# EasyEDA Pro project DRV8701_驱动.epro

# Schematic Schematic1
Board Name: Board1; Create Date: 2024-05-03; Page Name: P1; Project Name: 驱动; Schematic Name: Schematic1; Update Date: 2024-12-27; Company: 嘉立创EDA; Page Size: A4; Version: V1.0
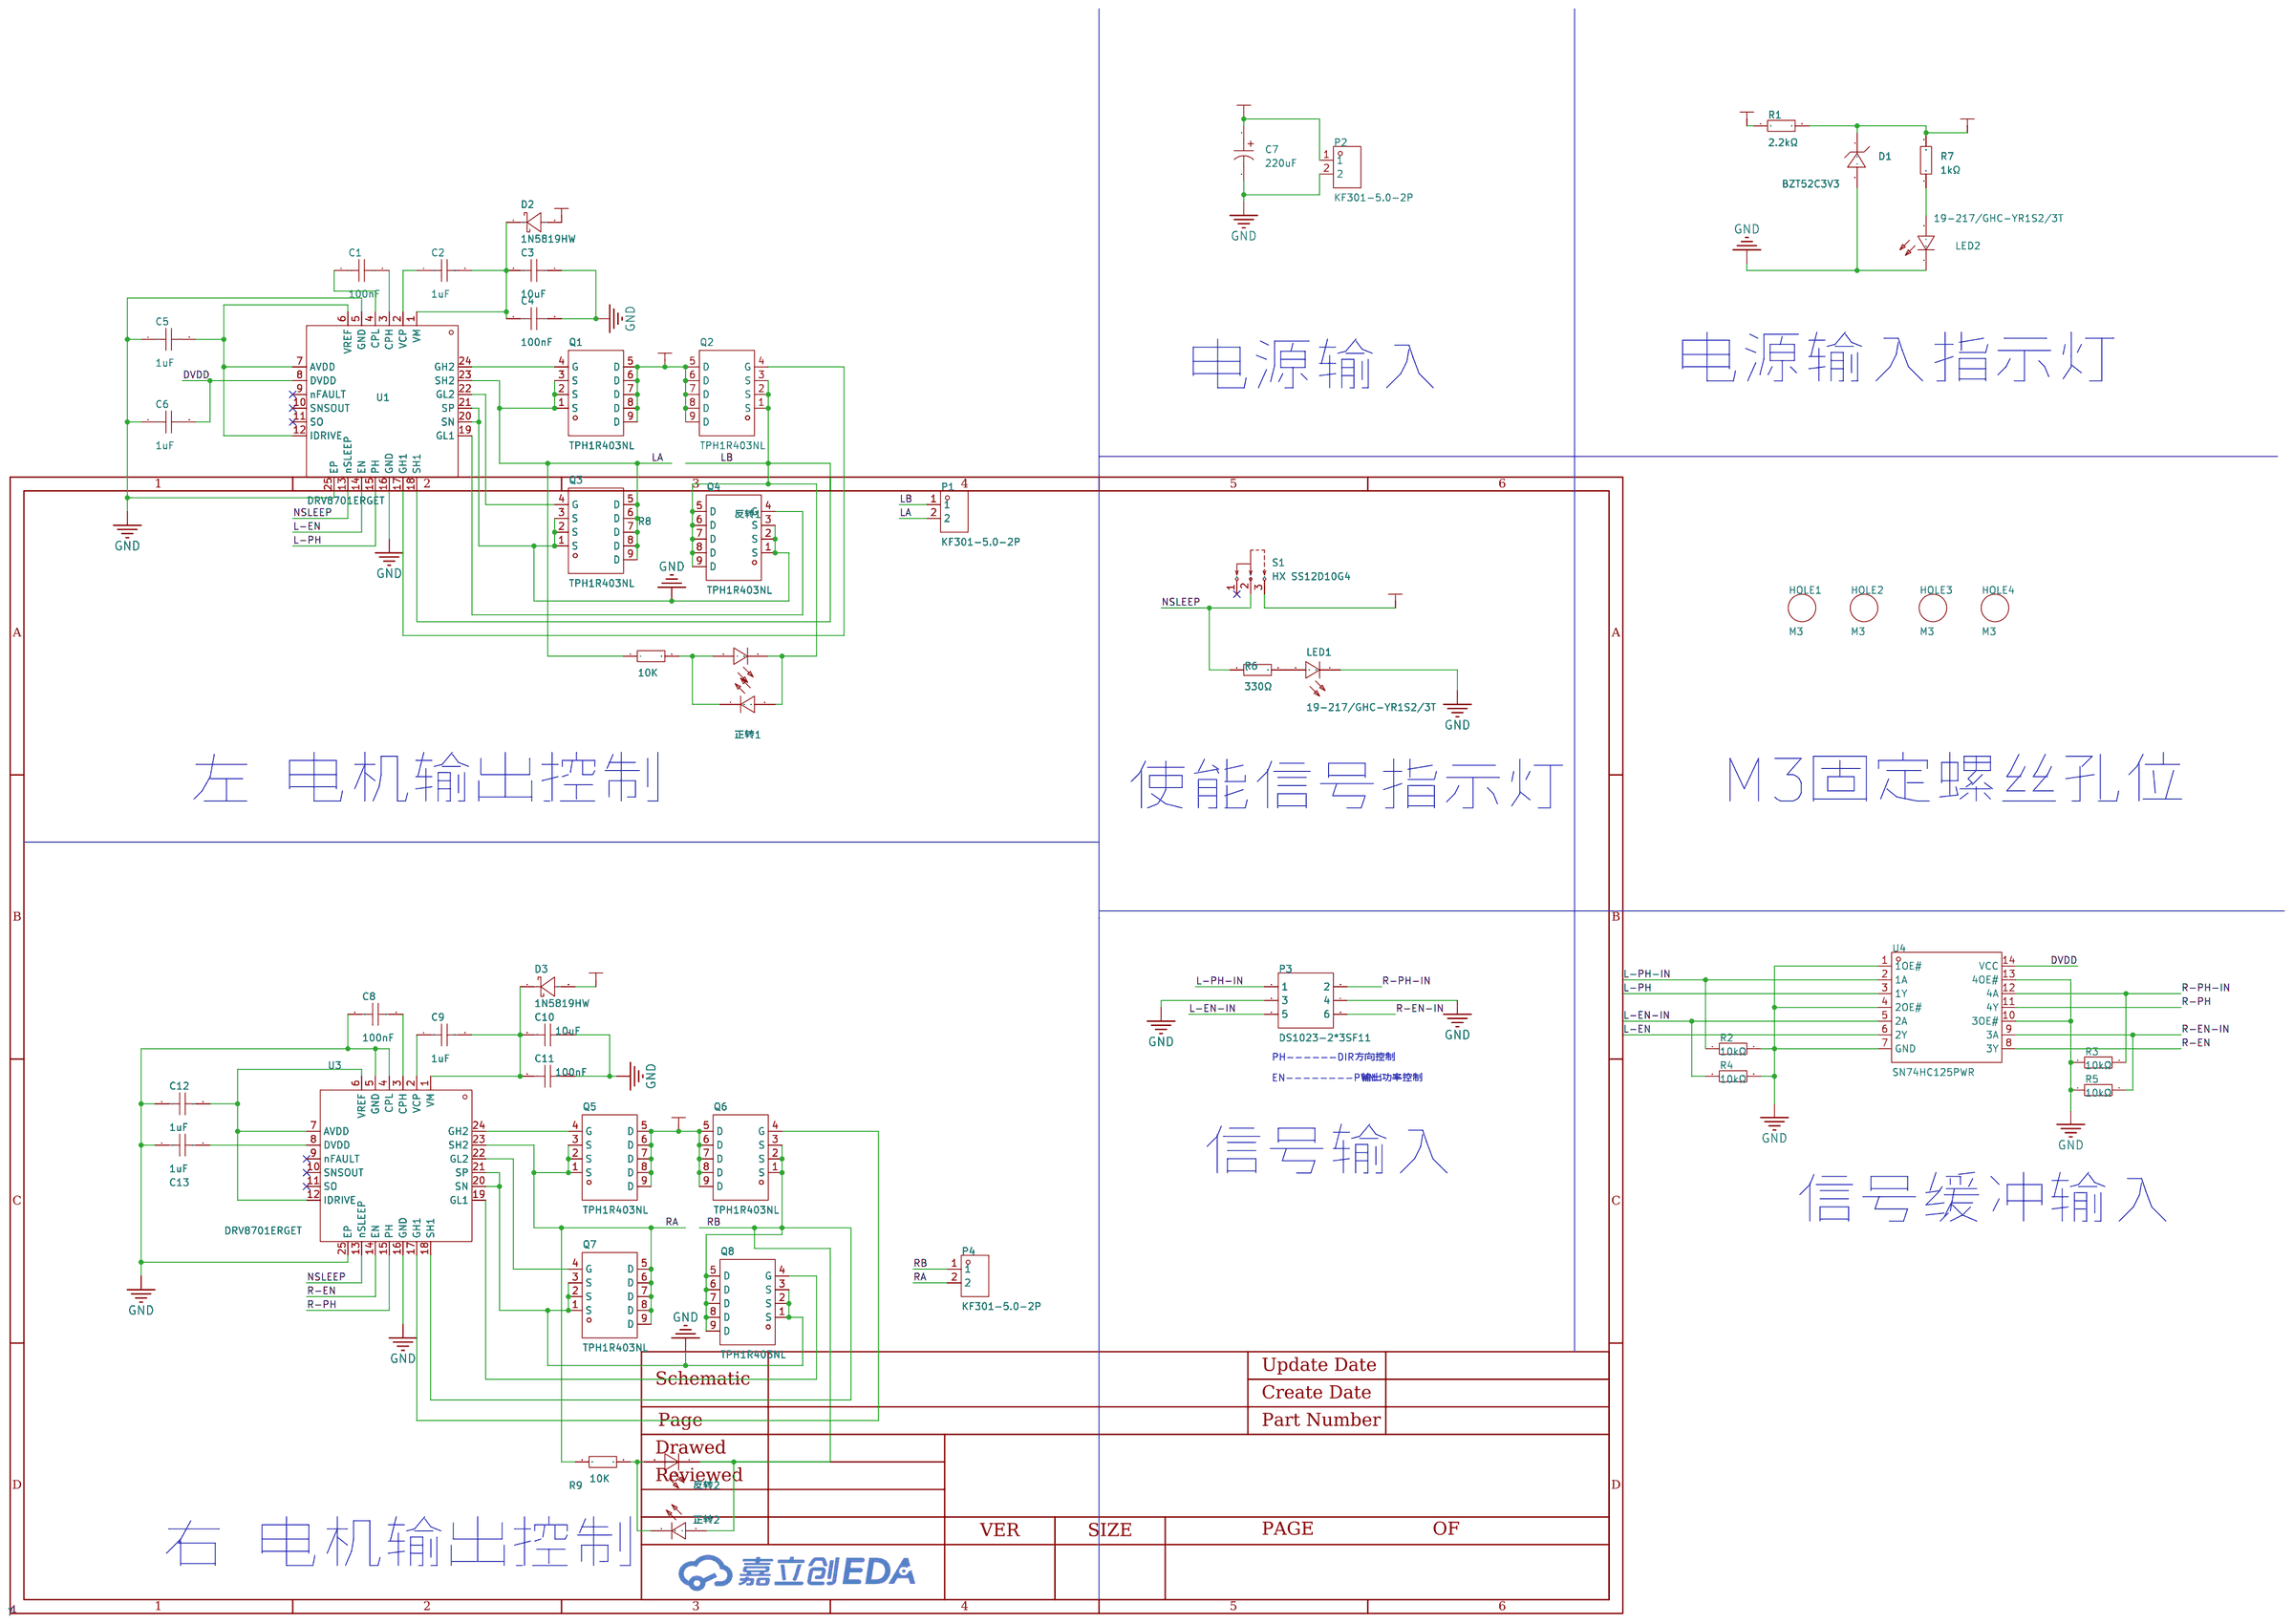
[diagram p0: schematic sheet]

## Parts
C1  100nF  [C0603]
C2  1uF  [C0603]
C3  10uF  [C0603]
C4  100nF  [C0603]
C5  1uF  [C0603]
C6  1uF  [C0603]
C7  220uF  [CAP-TH_BD6.3-P2.50-D1.0-FD]
C8  100nF  [C0603]
C9  1uF  [C0603]
C10  10uF  [C0603]
C11  100nF  [C0603]
C12  1uF  [C0603]
C13  1uF  [C0603]
D1  BZT52C3V3  [SOD-123_L2.8-W1.8-LS3.7-RD]
D2  1N5819HW  [SOD-123_L2.7-W1.6-LS3.7-RD-1]
D3  1N5819HW  [SOD-123_L2.7-W1.6-LS3.7-RD-1]
HOLE1  M3  [M3 5.4MM]
HOLE2  M3  [M3 5.4MM]
HOLE3  M3  [M3 5.4MM]
HOLE4  M3  [M3 5.4MM]
LED1  19-217/GHC-YR1S2/3T  [LED0603-RD]
LED2  19-217/GHC-YR1S2/3T  [LED0603-RD]
P1  KF301-5.0-2P  [CONN-TH_P5.00_KF301-5.0-2P]
P2  KF301-5.0-2P  [CONN-TH_P5.00_KF301-5.0-2P]
P3  DS1023-2*3SF11  [HDR-TH_6P-P2.54-V-F-R2-C3-S2.54]
P4  KF301-5.0-2P  [CONN-TH_P5.00_KF301-5.0-2P]
Q1  TPH1R403NL  [DSOP-8_L5.0-W5.0-P1.27-LS6.0-BL-EP]
Q2  TPH1R403NL  [DSOP-8_L5.0-W5.0-P1.27-LS6.0-BL-EP]
Q3  TPH1R403NL  [DSOP-8_L5.0-W5.0-P1.27-LS6.0-BL-EP]
Q4  TPH1R403NL  [DSOP-8_L5.0-W5.0-P1.27-LS6.0-BL-EP]
Q5  TPH1R403NL  [DSOP-8_L5.0-W5.0-P1.27-LS6.0-BL-EP]
Q6  TPH1R403NL  [DSOP-8_L5.0-W5.0-P1.27-LS6.0-BL-EP]
Q7  TPH1R403NL  [DSOP-8_L5.0-W5.0-P1.27-LS6.0-BL-EP]
Q8  TPH1R403NL  [DSOP-8_L5.0-W5.0-P1.27-LS6.0-BL-EP]
R1  2.2kΩ  [R0603]
R2  10kΩ  [R0603]
R3  10kΩ  [R0603]
R4  10kΩ  [R0603]
R5  10kΩ  [R0603]
R6  330Ω  [R0603]
R7  1kΩ  [R0603]
R8  10K  [R0603]
R9  10K  [R0603]
S1  HX SS12D10G4  [SW-TH_SHOU-HAN_SS12D10G4]
U1  DRV8701ERGET  [VQFN-24_L4.0-W4.0-P0.50-BL-EP2.5]
U3  DRV8701ERGET  [VQFN-24_L4.0-W4.0-P0.50-BL-EP2.5]
U4  SN74HC125PWR  [TSSOP-14_L5.0-W4.4-P0.65-LS6.5-BL]
反转1  19-217/GHC-YR1S2/3T  [LED0603-RD]
反转2  19-217/GHC-YR1S2/3T  [LED0603-RD]
正转1  19-217/GHC-YR1S2/3T  [LED0603-RD]
正转2  19-217/GHC-YR1S2/3T  [LED0603-RD]

## Library data of the parts
C1 C4 C8 C11 = LD03YC104KAB2A\500: 容值:100nF;精度:±10%;额定电压:16V;材质(温度系数):X7R;; LCSC Part Name: 100nF ±10% 16V; Supplier Part: C2311502; Manufacturer: Kyocera AVX; Supplier Footprint: 0603; JLCPCB Part Class: Extended Part; Datasheet: https://atta.szlcsc.com/upload/public/pdf/source/20211207/B657114075C6FC0CF56B8CD471711F32.pdf; Supplier: LCSC; Tolerance: ±10%; Voltage Rated: 16V; Temperature Coefficient: X7R
C2 C5 C6 C9 C12 C13 = JMK063ABJ105MP-F: 容值:1uF;精度:±20%;额定电压:6.3V;材质(温度系数):X5R;; LCSC Part Name: 1uF ±20% 6.3V; Supplier Part: C87143; Manufacturer: TAIYO YUDEN(太诱); Supplier Footprint: 0201; JLCPCB Part Class: Extended Part; Datasheet: https://atta.szlcsc.com/upload/public/pdf/source/20161110/1478747660296.pdf; Supplier: LCSC; Tolerance: ±20%; Voltage Rated: 6.3V; Temperature Coefficient: X5R
C3 C10 = 10uF_C15415: 容值:10uF;精度:±20%;额定电压:16V;材质(温度系数):-;; LCSC Part Name: 10uF ±20% 16V; Supplier Part: C15415; Manufacturer: SAMSUNG(三星); Supplier Footprint: 0603; JLCPCB Part Class: Extended Part; Datasheet: https://atta.szlcsc.com/upload/public/pdf/source/20160103/1457707675960.pdf; Supplier: LCSC; Tolerance: ±20%; Voltage Rated: 16V
C7 = 25YXJ220M6.3X11: 容值:220uF;精度:±20%;额定电压:25V;纹波电流:400mA@100kHz;等效串联电阻:220mΩ@100kHz;; LCSC Part Name: 220uF ±20% 25V; Supplier Part: C88729; Manufacturer: rubycon(红宝石); Supplier Footprint: 插件,D6.3xL11mm; JLCPCB Part Class: Extended Part; Datasheet: https://atta.szlcsc.com/upload/public/pdf/source/20161125/1480067872683.pdf; Supplier: LCSC; Tolerance: ±20%; Rated Voltage: 25V; φD: 6.3mm; L: 11mm; Lead Spacing: 2.5mm; Ripple Current: 400mA@100kHz; Equivalent Series Resistance(ESR): 220mΩ@100kHz; Lifetime @ Temp: 7000hrs@105℃
D1 = BZT52C3V3_C2112: 二极管配置:独立式;稳压值(标称值):3.3V;稳压值(范围):3.1V~3.5V;精度:-;功率:350mW;反向电流(Ir):5uA@1V;阻抗(Zzt):95Ω;; LCSC Part Name: 3.3V 350mW; Supplier Part: C2112; Manufacturer: CJ(江苏长电/长晶); Supplier Footprint: SOD-123; JLCPCB Part Class: Extended Part; Datasheet: https://atta.szlcsc.com/upload/public/pdf/source/20170919/C2112_1505799672426977594.pdf; Supplier: LCSC; Diode Configuration: 独立式; Zener Voltage (Nom): 3.3V; Zener Voltage (Range): 3.1V~3.5V; Power Dissipation: 350mW; Reverse Leakage Current (Ir): 5uA@1V; Zener Impedance (Zzt): 95Ω
D2 D3 = 1N5819HW: 二极管配置:-;直流反向耐压(Vr):40V;平均整流电流(Io):1A;正向压降(Vf):900mV@3A;反向电流(Ir):1mA@40V;; LCSC Part Name: 40V 1A 900mV@3A; Supplier Part: C2905649; Manufacturer: TECH PUBLIC(台舟); Supplier Footprint: SOD-123; JLCPCB Part Class: Extended Part; Datasheet: https://atta.szlcsc.com/upload/public/pdf/source/20211020/8C6B6169F42B21129AF0D528B0E96B00.pdf; Supplier: LCSC; Reverse Voltage (Vr): 40V; Average Rectified Current (Io): 1A; Forward Voltage (Vf@If): 900mV@3A; Reverse Leakage Current (Ir): 1mA@40V
HOLE1-HOLE4 = M3: BOM名称: 铜柱孔; 学习资源: www.ooocke.com; 版权归属: 源创客
LED1 LED2 反转1 反转2 正转1 正转2 = 19-217/GHC-YR1S2/3T: 发光颜色:翠绿;二极管配置:-;主波长:520nm~535nm;色温:-;功率:110mW;安装方式:-;; Supplier Part: C72043; Manufacturer: EVERLIGHT(亿光); Supplier Footprint: 0603; JLCPCB Part Class: Basic Part; Datasheet: https://atta.szlcsc.com/upload/public/pdf/source/20160507/1462613613780.pdf; Supplier: LCSC; Emitted Color: 翠绿; Lens Color: 无色透明; Dominant Wavelength: 520nm~535nm; Peak Wavelength: 518nm; Forward Current: 20mA; Power Dissipation: 110mW; Viewing Angle: 120°; Operating Temperature: -40℃~+85℃
P1 P2 P4 = KF301-5.0-2P: 间距:5mm;排数:1;每排PIN数:2;安装方式:直针;额定电流:17A;额定电压:250V;线规 - AWG:14~22;线规 - mm?:1.5;工作温度范围:-30℃~+120℃;颜色:蓝色;; LCSC Part Name: 5mm 排数:1 每排P数:2 直针 可拼接 铜 环保; Supplier Part: C474881; Manufacturer: KEFA(科发); Supplier Footprint: 直插,P=5mm; JLCPCB Part Class: Extended Part; Datasheet: https://atta.szlcsc.com/upload/public/pdf/source/20200115/C474881_883EFE2003339C40FD1BEEEFC9A18423.pdf; Supplier: LCSC; Pitch: 5mm; Number of Rows: 1; Number of PINs Per Row: 2; Mounting Style: 直针; Current Rating (Max): 17A; Voltage Rating (Max): 250V; Wire Gauge - AWG: 14~22; Wire Gauge - mm?: 1.5; Operating Temperature Range: -30℃~+120℃; Color: 蓝色
P3 = DS1023-2*3SF11: 排数:双排;总孔位数:6;间距:2.54mm;插孔结构:2x3P;行距:2.54mm;安装类型:直插;塑高:-;触头材质:-;触头镀层:-;; LCSC Part Name: 2.54mm 2x3P; Supplier Part: C92272; Manufacturer: CONNFLY; Supplier Footprint: 插件,P=2.54mm; JLCPCB Part Class: Extended Part; Datasheet: https://atta.szlcsc.com/upload/public/pdf/source/20200424/C92272_A95D2DA05ACA87B9C9B122019351705D.pdf; Supplier: LCSC; Number of Rows: 双排; Number of Holes: 6; Pitch: 2.54mm; Holes Structure: 2x3P; Row Spacing: 2.54mm; Mounting Type: 直插
Q1-Q8 = TPH1R403NL_C83440: 类型:N沟道;漏源电压(Vdss):30V;连续漏极电流(Id):150A;功率(Pd):64W;导通电阻(RDS(on)@Vgs,Id):1.4mΩ@10V,30A;阈值电压(Vgs(th)@Id):2.3V@500uA;; LCSC Part Name: N沟道 30V 150A; Supplier Part: C83440; Manufacturer: TOSHIBA(东芝); Supplier Footprint: DSOP-8-EP-5.0mm; JLCPCB Part Class: Extended Part; Datasheet: https://atta.szlcsc.com/upload/public/pdf/source/20170908/C83440_1504870121708958077.pdf; Supplier: LCSC; Type: N沟道; Drain Source Voltage (Vdss): 30V; Continuous Drain Current (Id): 150A; Power Dissipation (Pd): 64W; Drain Source On Resistance (RDS(on)@Vgs,Id): 1.4mΩ@10V,30A; Gate Threshold Voltage (Vgs(th)@Id): 2.3V@500uA
R1 = RC0805JR-072K2L: 电阻类型:厚膜电阻;阻值:2.2kΩ;精度:±5%;功率:125mW;; LCSC Part Name: 2.2kΩ ±5% 125mW; Supplier Part: C114237; Manufacturer: YAGEO(国巨); Supplier Footprint: 0805; JLCPCB Part Class: Extended Part; Datasheet: https://atta.szlcsc.com/upload/public/pdf/source/20170705/1499242706674.pdf; Supplier: LCSC; Type: 厚膜电阻; Tolerance: ±5%; Power(Watts): 125mW; Temperature Coefficient: ±100ppm/℃; Overload Voltage (Max): 150V; Operating Temperature Range: -55℃~+155℃
R2-R5 = AC0603FR-0710KL: 电阻类型:厚膜电阻;阻值:10kΩ;精度:±1%;功率:100mW;; LCSC Part Name: 10kΩ ±1% 100mW; Supplier Part: C116677; Manufacturer: YAGEO(国巨); Supplier Footprint: 0603; JLCPCB Part Class: Extended Part; Datasheet: https://atta.szlcsc.com/upload/public/pdf/source/20171106/C116677_15099694143531094015.pdf; Supplier: LCSC; Type: 厚膜电阻; Tolerance: ±1%; Power(Watts): 100mW; Temperature Coefficient: ±100ppm/℃; Overload Voltage (Max): 75V; Operating Temperature Range: -55℃~+155℃
R6 = 0402WGF3300TCE: 电阻类型:厚膜电阻;阻值:330Ω;精度:±1%;功率:62.5mW;; LCSC Part Name: 330Ω ±1% 62.5mW; Supplier Part: C25104; Manufacturer: UNI-ROYAL(厚声); Supplier Footprint: 0402; JLCPCB Part Class: Basic Part; Datasheet: https://atta.szlcsc.com/upload/public/pdf/source/20200306/C422600_1E6D84923E4A46A82E41ADD87F860B5C.pdf; Supplier: LCSC; Type: 厚膜电阻; Tolerance: ±1%; Power(Watts): 62.5mW; Temperature Coefficient: ±100ppm/℃; Overload Voltage (Max): 50V; Operating Temperature Range: -55℃~+155℃
R7 = ACD03K102JT: 阻值:1kΩ;精度:±5%;功率:100mW;; LCSC Part Name: 1kΩ ±5% 100mW; Supplier Part: C347057; Manufacturer: FH(风华); Supplier Footprint: 0603; JLCPCB Part Class: Extended Part; Datasheet: https://atta.szlcsc.com/upload/public/pdf/source/20181211/C347057_E87C81A5B9F44443BA9931DC1484DEF8.pdf; Supplier: LCSC; Tolerance: ±5%; Power(Watts): 100mW; Temperature Coefficient: ±100ppm/℃; Overload Voltage (Max): 50V; Operating Temperature Range: -55℃~+155℃
R8 R9 = Res_0603: Supplier Footprint: 0603
S1 = HX SS12D10G4: LCSC Part Name: 拨动开关 立式两档拨动,单排3脚插件,12.7x6.7x6.4,黑柄4mm; Supplier Part: C5149841; Manufacturer: hanxia(韩下); Supplier Footprint: 插件; JLCPCB Part Class: Extended Part; Datasheet: https://atta.szlcsc.com/upload/public/pdf/source/20220907/2020D7183ED16DD6E2B9F5A13FB144CF.pdf; Supplier: LCSC
U1 U3 = DRV8701ERGET: 电源电压:0V~5.5V;输出电流:-;接口:并行;; Supplier Part: C132049; Manufacturer: TI(德州仪器); Supplier Footprint: VQFN-24(4x4); JLCPCB Part Class: Extended Part; Datasheet: https://atta.szlcsc.com/upload/public/pdf/source/20170925/C132049_1506321643935990409.pdf; Supplier: LCSC; Type: 有刷直流电机; Supply Voltage: 0V~5.5V; Interface: 并行; Operating Temperature: -40℃~+125℃@(Ta)
U4 = SN74HC125PWR: 类型:缓冲器，非反相;电源电压:2V~6V;输入类型:-;输出类型:三态;低电平输出电流(IOL):7.8mA;高电平输出电流(IOH):7.8mA;工作温度:-40℃~+85℃;; Supplier Part: C132994; Manufacturer: TI(德州仪器); Supplier Footprint: TSSOP-14; JLCPCB Part Class: Extended Part; Datasheet: https://atta.szlcsc.com/upload/public/pdf/source/20170930/C132994_1506736365150997346.pdf; Supplier: LCSC; Type: 缓冲器，非反相; Supply Voltage: 2V~6V; output type: 三态; Current-OutputLow: 7.8mA; Current-OutputHigh: 7.8mA; Operating temperature: -40℃~+85℃

## Nets
3V3: D1.1(K) R1.2 R7.2 S1.3
DVDD: C6.2 U1.8(DVDD) U4.14(VCC)
GND: C3.1 C4.2 C5.1 C6.1 C7.2 C8.1 C10.1 C11.2 C12.1 C13.1 D1.2(A) LED1.1(C) LED2.1(C) P2.2 P3.3 P3.4 Q3.1(S) Q3.2(S) Q3.3(S) Q4.1(S) Q4.2(S) Q4.3(S) Q7.1(S) Q7.2(S) Q7.3(S) Q8.1(S) Q8.2(S) Q8.3(S) R2.2 R3.1 R4.2 R5.1 U1.5(GND) U1.16(GND) U1.20(SN) U1.21(SP) U1.25(EP) U3.4(CPL) U3.5(GND) U3.16(GND) U3.20(SN) U3.21(SP) U3.25(EP) U4.1(1OE#) U4.4(2OE#) U4.7(GND) U4.10(3OE#) U4.13(4OE#)
L-EN: U1.14(EN) U4.6(2Y)
L-EN-IN: P3.5 R4.1 U4.5(2A)
L-PH: U1.15(PH) U4.3(1Y)
L-PH-IN: P3.1 R2.1 U4.2(1A)
LA: P1.2 Q1.1(S) Q1.2(S) Q1.3(S) Q3.5(D) Q3.6(D) Q3.7(D) Q3.8(D) Q3.9(D) R8.1 U1.23(SH2)
LB: P1.1 Q2.1(S) Q2.2(S) Q2.3(S) Q4.5(D) Q4.6(D) Q4.7(D) Q4.8(D) Q4.9(D) U1.18(SH1) 反转1.1(C) 正转1.2(A)
NSLEEP: R6.1 S1.2 U1.13(nSLEEP) U3.13(nSLEEP)
R-EN: U3.14(EN) U4.8(3Y)
R-EN-IN: P3.6 R5.2 U4.9(3A)
R-PH: U3.15(PH) U4.11(4Y)
R-PH-IN: P3.2 R3.2 U4.12(4A)
RA: P4.2 Q5.1(S) Q5.2(S) Q5.3(S) Q7.5(D) Q7.6(D) Q7.7(D) Q7.8(D) Q7.9(D) R9.1 U3.23(SH2)
RB: P4.1 Q6.1(S) Q6.2(S) Q6.3(S) Q8.5(D) Q8.6(D) Q8.7(D) Q8.8(D) Q8.9(D) U3.18(SH1) 反转2.1(C) 正转2.2(A)
VM: C7.1 D2.2(A) D3.2(A) P2.1 Q1.5(D) Q1.6(D) Q1.7(D) Q1.8(D) Q1.9(D) Q2.5(D) Q2.6(D) Q2.7(D) Q2.8(D) Q2.9(D) Q5.5(D) Q5.6(D) Q5.7(D) Q5.8(D) Q5.9(D) Q6.5(D) Q6.6(D) Q6.7(D) Q6.8(D) Q6.9(D) R1.1
$1N5930: C1.2 U1.3(CPH)
$1N5954: C1.1 U1.4(CPL)
$1N6062: C5.2 U1.6(VREF) U1.7(AVDD) U1.12(IDRIVE)
$1N6123: Q1.4(G) U1.24(GH2)
$1N6219: Q3.4(G) U1.22(GL2)
$1N6658: Q2.4(G) U1.17(GH1)
$1N7382: C8.2 U3.3(CPH)
$1N7388: C13.2 U3.8(DVDD)
$1N7390: C12.2 U3.6(VREF) U3.7(AVDD) U3.12(IDRIVE)
$1N7398: Q5.4(G) U3.24(GH2)
$1N7402: Q7.4(G) U3.22(GL2)
$1N7417: Q6.4(G) U3.17(GH1)
$1N8697: LED2.2(A) R7.1
$1N9446: LED1.2(A) R6.2
$1N9774: Q4.4(G) U1.19(GL1)
$1N9780: Q8.4(G) U3.19(GL1)
$1N16923: C9.1 U3.2(VCP)
$1N17082: C9.2 C10.2 C11.1 D3.1(K) U3.1(VM)
$1N17114: C2.1 U1.2(VCP)
$1N17118: C2.2 C3.2 C4.1 D2.1(K) U1.1(VM)
$1N20092: R8.2 反转1.2(A) 正转1.1(C)
$1N20294: R9.2 反转2.2(A) 正转2.1(C)

Not connected (* = marked no-connect by the designer): S1 1*; U1 9(nFAULT)* 10(SNSOUT)* 11(SO)*; U3 9(nFAULT)* 10(SNSOUT)* 11(SO)*

## Notes on the sheet
- 电源输入指示灯
- 电源输入
- 左 电机输出控制
- M3固定螺丝孔位
- 使能信号指示灯
- PH------DIR
- 方向控制
- EN--------PWM
- 输出功率控制
- 信号输入
- 信号缓冲输入
- 右 电机输出控制

# Board PCB1
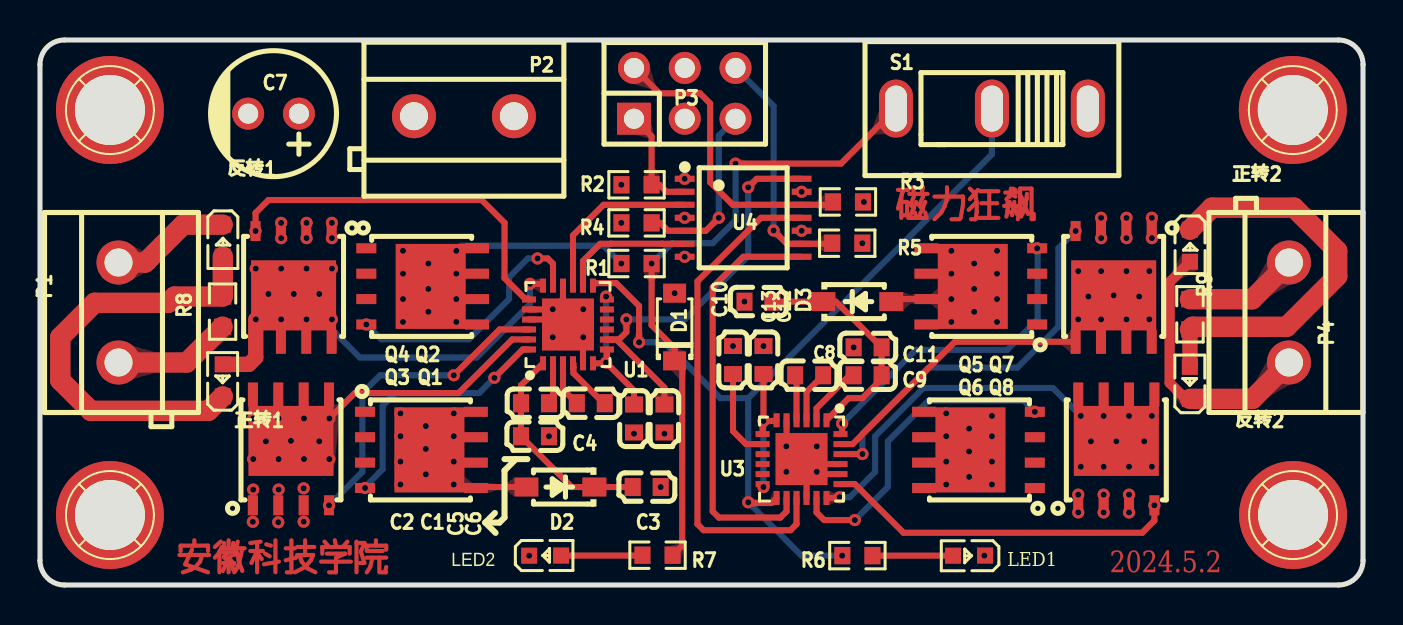
[diagram p1: board, top side]
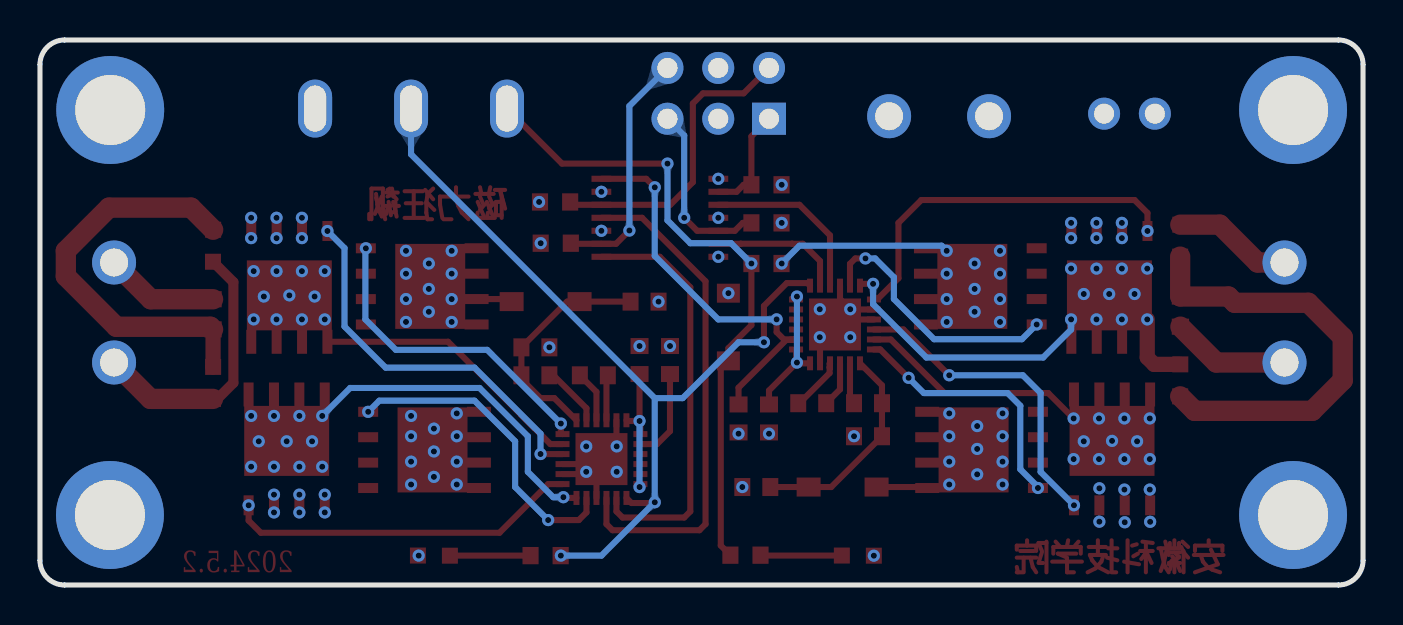
[diagram p2: board, bottom side, seen from below]

Outline 66.19 x 27.25 mm; copper layers: Top Layer, VM, GND, Bottom Layer. Coordinates in mm from the lower left corner of the outline.
Outline path: 0,26.02 0,1.23 arc(0.36,0.36) 1.23,0 64.96,0 arc(65.83,0.36) 66.19,1.23 66.19,26.02 arc(65.83,26.89) 64.96,27.25 1.23,27.25 arc(0.36,26.89) 0,26.02
Stack: Top Layer 0.035mm / Dielectric1 0.48mm PP er 4.5 / VM 0.035mm / Dielectric2 0.48mm FR4 er 4.5 / GND 0.035mm / Dielectric3 0.48mm PP er 4.5 / Bottom Layer 0.035mm

## Design rules (mm)
spacing copperThickness1oz (default): track to track 0.178, other pairs 0.178 to 0.178
spacing copperThickness2oz: track to track 0.203, other pairs 0.152 to 0.3
track width copperThickness1oz (default): min 0.127, default 0.254, max 2.54
track width copperThickness2oz: min 0.203, default 0.254, max 2.54
differential pair differentialPair (default): width min 0.127, default 0.254, max 2.54; gap min 0.152, default 0.152
via viaSize (default): diameter min 0.5, default 0.61, max 10; hole min 0.3, default 0.305, max 6.299

## Placement (name value [footprint] x y rotation side)
C1  100nF  [C0603]  27.56 9.09 180 top
C2  1uF  [C0603]  24.76 9.09 180 top
C3  10uF  [C0603]  30.35 4.9 180 top
C4  100nF  [C0603]  24.76 7.44 0 top
C5  1uF  [C0603]  29.72 8.33 90 top
C6  1uF  [C0603]  31.24 8.33 90 top
C7  220uF  [CAP-TH_BD6.3-P2.50-D1.0-FD]  11.68 23.57 180 top
C8  100nF  [C0603]  38.48 10.49 0 top
C9  1uF  [C0603]  41.41 10.49 0 top
C10  10uF  [C0603]  35.94 14.17 0 top
C11  100nF  [C0603]  41.41 11.88 180 top
C12  1uF  [C0603]  36.19 11.25 270 top
C13  1uF  [C0603]  34.67 11.25 270 top
D1  BZT52C3V3  [SOD-123_L2.8-W1.8-LS3.7-RD]  31.75 12.9 90 top
D2  1N5819HW  [SOD-123_L2.7-W1.6-LS3.7-RD-1]  26.03 4.9 180 top
D3  1N5819HW  [SOD-123_L2.7-W1.6-LS3.7-RD-1]  40.89 14.17 0 top
HOLE1  M3  [m3 5.4mm]  62.68 23.75 0 top
HOLE2  M3  [m3 5.4mm]  3.5 23.75 0 top
HOLE3  M3  [m3 5.4mm]  3.5 3.5 0 top
HOLE4  M3  [m3 5.4mm]  62.69 3.5 0 top
LED1  19-217/GHC-YR1S2/3T  [LED0603-RD]  46.48 1.47 180 top
LED2  19-217/GHC-YR1S2/3T  [LED0603-RD]  25.27 1.47 0 top
P1  KF301-5.0-2P  [CONN-TH_P5.00_KF301-5.0-2P]  3.93 13.62 270 top
P2  KF301-5.0-2P  [CONN-TH_P5.00_KF301-5.0-2P]  21.21 23.44 180 top
P3  DS1023-2*3SF11  [HDR-TH_6P-P2.54-V-F-R2-C3-S2.54]  32.26 24.58 0 top
P4  KF301-5.0-2P  [CONN-TH_P5.00_KF301-5.0-2P]  62.48 13.63 90 top
Q1  TPH1R403NL  [DSOP-8_L5.0-W5.0-P1.27-LS6.0-BL-EP]  19.03 6.75 270 top
Q2  TPH1R403NL  [DSOP-8_L5.0-W5.0-P1.27-LS6.0-BL-EP]  19.1 14.93 270 top
Q3  TPH1R403NL  [DSOP-8_L5.0-W5.0-P1.27-LS6.0-BL-EP]  12.56 6.76 0 top
Q4  TPH1R403NL  [DSOP-8_L5.0-W5.0-P1.27-LS6.0-BL-EP]  12.69 14.93 180 top
Q5  TPH1R403NL  [DSOP-8_L5.0-W5.0-P1.27-LS6.0-BL-EP]  47.12 14.93 90 top
Q6  TPH1R403NL  [DSOP-8_L5.0-W5.0-P1.27-LS6.0-BL-EP]  47 6.75 90 top
Q7  TPH1R403NL  [DSOP-8_L5.0-W5.0-P1.27-LS6.0-BL-EP]  53.72 14.93 180 top
Q8  TPH1R403NL  [DSOP-8_L5.0-W5.0-P1.27-LS6.0-BL-EP]  53.85 6.75 0 top
R1  2.2kΩ  [R0603]  29.84 16.07 0 top
R2  10kΩ  [R0603]  29.84 20.01 180 top
R3  10kΩ  [R0603]  40.42 19.15 180 top
R4  10kΩ  [R0603]  29.84 18.11 180 top
R5  10kΩ  [R0603]  40.39 17.09 180 top
R6  330Ω  [R0603]  40.89 1.47 0 top
R7  1kΩ  [R0603]  30.9 1.49 0 top
R8  10K  [R0603]  9.14 13.67 90 top
R9  10K  [R0603]  57.53 13.53 270 top
S1  HX SS12D10G4  [SW-TH_SHOU-HAN_SS12D10G4]  47.62 23.82 180 top
U1  DRV8701ERGET  [VQFN-24_L4.0-W4.0-P0.50-BL-EP2.5]  26.42 13.03 0 top
U3  DRV8701ERGET  [VQFN-24_L4.0-W4.0-P0.50-BL-EP2.5]  38.1 6.3 180 top
U4  SN74HC125PWR  [TSSOP-14_L5.0-W4.4-P0.65-LS6.5-BL]  35.18 18.36 270 top
反转1  19-217/GHC-YR1S2/3T  [LED0603-RD]  9.14 17.22 270 top
反转2  19-217/GHC-YR1S2/3T  [LED0603-RD]  57.53 10.11 90 top
正转1  19-217/GHC-YR1S2/3T  [LED0603-RD]  9.14 10.23 90 top
正转2  19-217/GHC-YR1S2/3T  [LED0603-RD]  57.53 16.96 270 top

## Footprints (pads in the part's own frame, mm; a bottom-side part is the same pattern mirrored in y, then rotated)
C0603
  rect 0.8x0.9 smd: 1(-0.7,0) 2(0.7,0)
CAP-TH_BD6.3-P2.50-D1.0-FD
  round 1.6 hole 1: 1(-1.27,0) 2(1.27,0)
CONN-TH_P5.00_KF301-5.0-2P
  round 2.2 hole 1.4: 1(-2.5,0) 2(2.5,0)
DSOP-8_L5.0-W5.0-P1.27-LS6.0-BL-EP
  rect 0.5x1 smd: 1(-1.905,-2.77) 2(-0.635,-2.77) 3(0.634,-2.77) 4(1.905,-2.77)
  rect 0.5x1.2 smd: 5(1.905,2.77) 6(0.635,2.77) 7(-0.634,2.77) 8(-1.905,2.77)
  custom 4.25x3.5 smd: 9(0,0.45)
HDR-TH_6P-P2.54-V-F-R2-C3-S2.54
  rect 1.7x1.6 hole 1: 1(-2.54,-1.27)
  round 1.6 hole 1: 2(-2.54,1.27) 3(0,-1.27) 4(0,1.27) 5(2.54,-1.27) 6(2.54,1.27)
LED0603-RD
  rect 0.8x0.8 smd: 1(-0.799,-0.004) 2(0.799,0.004)
m3 5.4mm
  round 5.4 hole 3.5: 0(0,0)
R0603
  rect 0.806x0.864 smd: 1(-0.753,0) 2(0.753,0)
SOD-123_L2.7-W1.6-LS3.7-RD-1
  rect 1.2x0.95 smd: 1(-1.7,0) 2(1.7,0)
SOD-123_L2.8-W1.8-LS3.7-RD
  rect 0.95x1.15 smd: 1(-1.692,0) 2(1.692,0)
SW-TH_SHOU-HAN_SS12D10G4
  oval 1.7x2.9 hole 1.1x2.3: 1(-4.8,0) 2(0,0) 3(4.8,0)
TSSOP-14_L5.0-W4.4-P0.65-LS6.5-BL
  rect 0.305x0.991 smd: 1(-1.95,-2.925) 2(-1.3,-2.925) 3(-0.65,-2.925) 4(0,-2.925) 5(0.65,-2.925) 6(1.3,-2.925) 7(1.95,-2.925) 8(1.95,2.925) 9(1.3,2.925) 10(0.65,2.925) 11(0,2.925) 12(-0.65,2.925) 13(-1.3,2.925) 14(-1.95,2.925)
VQFN-24_L4.0-W4.0-P0.50-BL-EP2.5
  rect 0.3x0.7 smd: 1(-1.25,-1.942) 2(-0.75,-1.942) 3(-0.25,-1.942) 4(0.25,-1.942) 5(0.75,-1.942) 6(1.25,-1.942) 13(1.25,1.942) 14(0.75,1.942) 15(0.25,1.942) 16(-0.25,1.942) 17(-0.75,1.942) 18(-1.25,1.942)
  rect 0.7x0.3 smd: 7(1.948,-1.25) 8(1.948,-0.75) 9(1.948,-0.25) 10(1.948,0.25) 11(1.948,0.75) 12(1.948,1.25) 19(-1.948,1.25) 20(-1.948,0.75) 21(-1.948,0.25) 22(-1.948,-0.25) 23(-1.948,-0.75) 24(-1.948,-1.25)
  rect 2.6x2.6 smd: 25(0.001,-0.001)

## Nets
As in the schematic, except:
GND: C3.1 C4.2 C5.1 C6.1 C7.2 C10.1 C11.2 C12.1 C13.1 D1.2 LED1.1 LED2.1 P2.2 P3.3 P3.4 Q3.1 Q3.2 Q3.3 Q4.1 Q4.2 Q4.3 Q7.1 Q7.2 Q7.3 Q8.1 Q8.2 Q8.3 R2.2 R3.1 R4.2 R5.1 U1.5 U1.16 U1.20 U1.21 U1.25 U3.5 U3.16 U3.20 U3.21 U3.25 U4.1 U4.4 U4.7 U4.10 U4.13
$1N7386: C8.1 U3.4

Pads without a net: HOLE1 0; HOLE2 0; HOLE3 0; HOLE4 0; S1 1; U1 9 10 11; U3 9 10 11

## Via types
v1: diameter 0.61, hole 0.305, Top Layer to Bottom Layer, 170 vias

## Routing (per net, layer and track width the routed paths; a pad name or vN(x,y) marks a point on that pad's centre or on a via; arc(x,y) is an arc through that point)
3V3: length 32.5
  Top Layer w0.305: v1(30.6,16.07) 30.6,12.99 31.75,11.84 D1.1 32.13,10.83 32.13,1.97 R7.2 ; S1.3 40.07,21.07 v1(34.8,21.07)
  Bottom Layer w0.305: v1(30.6,16.07) 31.61,17.09 33.66,17.09 34.8,18.23 v1(34.8,21.07)
DVDD: length 20.2
  Top Layer w0.305: v1(29.34,13.28) 29.34,12.64 28.97,12.28 U1.8 28.38,12.26 28.56,12.26 28.57,12.26 28.85,12.26 31.24,9.86 C6.2 ; v1(35.43,19.88) 35.86,20.31 U4.14
  Bottom Layer w0.305: v1(35.43,19.88) 35.43,16.45 32.26,13.28 v1(29.34,13.28)
GND: length 13.9
  Top Layer w0.305: U1.5 27.17,12.38 v1(27.18,12.39) ; 26.42,13.03 26.17,13.28 U1.21 ; U3.16 38.35,6.05 ; 38.35,6.05 38.85,5.55 U3.20 ; 38.35,6.05 38.22,6.05 v1(37.34,6.93) 37.35,6.94 U3.5 ; 38.35,6.05 U3.21 ; U1.20 25.64,13.78 26.17,14.3 U1.16
  vias: v1(10.67,4.77) v1(10.65,3.16) v1(11.94,4.77) v1(11.92,3.14) v1(12.06,18.11) v1(12.06,17.34) v1(13.19,4.83) v1(13.19,3.17) v1(13.34,18.11) v1(13.34,17.34) v1(14.6,18.11) v1(14.6,17.34) v1(24.47,1.47) v1(25.47,7.44) v1(25.65,13.79) v1(25.65,12.39) v1(27.18,13.79) v1(29.08,20.01) v1(29.08,18.11) v1(29.72,7.56) v1(31.05,4.9) v1(31.24,7.56) v1(31.75,14.59) v1(32.25,20.31) v1(32.25,18.36) v1(32.25,16.41) v1(34.67,11.95) v1(35.24,14.17) v1(36.19,11.95) v1(37.34,5.66) v1(38.1,19.66) v1(38.1,17.71) v1(38.86,6.93) v1(38.86,5.66) v1(40.71,11.88) v1(41.14,17.09) v1(41.22,19.15) v1(47.24,1.47) v1(51.94,4.52) v1(51.94,3.63) v1(53.09,18.36) v1(53.09,17.34) v1(53.21,4.52) v1(53.21,3.63) v1(54.36,18.36) v1(54.36,17.34) v1(54.48,4.52) v1(54.48,3.63) v1(55.63,18.36) v1(55.63,17.34)
L-EN: length 6.7
  Top Layer w0.305: U1.14 27.17,16.2 28.03,17.06 28.56,17.06 28.56,17.06 31.13,17.06 31.13,17.06 U4.6
L-EN-IN: length 9.1
  Top Layer w0.305: R4.1 31.03,18.11 31.43,17.71 U4.5 33.31,17.71 v1(33.96,18.36)
  Bottom Layer w0.305: P3.5 33.96,22.48 v1(33.96,18.36)
L-PH: length 8.7
  Top Layer w0.305: U1.15 26.67,17.48 28.19,19.01 U4.3
L-PH-IN: length 5.5
  Top Layer w0.305: P3.1 30.6,22.43 R2.1 30.99,20.01 31.34,19.66 U4.2
LA: length 17.6
  Top Layer w0.305: v1(14.48,8.33) 15.75,9.6 20.94,9.6 23.62,12.28 U1.23
  Top Layer w1.016: R8.1 7.34,11.12 P1.2
  vias: v1(10.67,8.33) v1(10.67,6.3) v1(11.3,7.18) v1(11.94,8.33) v1(11.94,6.3) v1(12.56,7.21) v1(13.21,8.33) v1(13.21,6.3) v1(13.97,7.18) v1(14.48,6.3)
LB: length 23.5
  Top Layer w0.305: U1.18 25.08,15.06 v1(24.51,15.06)
  Top Layer w0.762: v1(10.79,13.28) 10.79,11.38 10.45,11.03 正转1.2
  Top Layer w1.016: P1.1 5.27,16.12 7.17,18.02 反转1.1
  Bottom Layer w0.305: v1(24.51,15.06) 24.51,14.04 21.84,11.38 16,11.38 14.6,12.77 v1(14.6,13.28)
  vias: v1(10.79,15.82) v1(11.43,14.55) v1(12.06,15.82) v1(12.06,13.28) v1(12.7,14.55) v1(13.34,15.82) v1(13.34,13.28) v1(13.97,14.55) v1(14.6,15.82)
NSLEEP: length 43.3
  Top Layer w0.305: U3.13 36.6,4.1 35.47,4.1 v1(35.43,4.14) ; U1.13 27.79,15.09 28.83,15.09 29.97,13.95 v1(29.97,12.14)
  Bottom Layer w0.305: 35.43,9.34 34.04,9.34 31.24,12.14 v1(29.97,12.14) ; 35.43,9.34 v1(35.43,4.14) 38.1,1.47 v1(40.13,1.47) ; 35.43,9.34 47.62,21.53 S1.2
R-EN: length 20.9
  Top Layer w0.305: U3.14 37.35,3.68 37.04,3.37 33.96,3.37 33.66,3.68 33.66,14.89 35.18,16.41 U4.8
R-EN-IN: length 12.1
  Top Layer w0.305: v1(36.7,17.72) 37.37,17.06 U4.9 39.6,17.06 R5.2
  Bottom Layer w0.305: P3.6 36.7,23.95 v1(36.7,17.72)
R-PH: length 25.2
  Top Layer w0.305: U4.11 36.07,18.36 32.89,15.19 32.89,3.04 33.2,2.74 37.55,2.74 37.85,3.04 U3.15
R-PH-IN: length 15.1
  Top Layer w0.305: R3.2 39.52,19.01 U4.12 34.66,19.01 33.53,20.14 33.53,24.08 33.02,24.58 30.99,24.58 P3.2
RA: length 22.9
  Top Layer w0.305: 53.09,13.85 v1(53.09,15.69) ; 53.09,13.85 v1(53.09,13.28) ; 53.09,13.85 53.72,14.48 ; U3.23 40.66,7.05 45.77,12.16 Q7.5
  Top Layer w1.016: P4.2 60.65,14.29 R9.1
  vias: v1(51.94,15.69) v1(51.94,13.28) v1(52.45,14.42) v1(53.72,14.48) v1(54.36,15.69) v1(54.36,13.28) v1(54.99,14.42) v1(55.5,15.69) v1(55.5,13.28)
RB: length 29.9
  Top Layer w0.305: U3.18 39.97,4.35 v1(40,4.39)
  Top Layer w0.508: 57.31,9.31 56.51,10.11 56.51,15.14 正转2.2
  Top Layer w1.016: P4.1 60.66,9.31 反转2.1
  Bottom Layer w0.305: v1(40,4.39) 40.51,4.39 41.78,5.66 41.78,7.44 44.2,9.85 50.67,9.85 v1(52.07,8.45)
  vias: v1(52.07,5.91) v1(52.58,7.18) v1(53.21,8.45) v1(53.21,5.91) v1(53.85,7.18) v1(54.48,8.45) v1(54.48,5.91) v1(55.25,7.18) v1(55.63,8.45) v1(55.63,5.91)
VM: length 15.5
  Top Layer w0.305: D2.2 20.83,4.9 v1(20.7,5.03) ; v1(45.59,14.3) 42.72,14.3 D3.2
  Bottom Layer w0.305: v1(20.83,16.71) 21.08,16.96 28.19,16.96 v1(29.08,16.07)
  vias: v1(18.03,8.58) v1(18.03,7.44) v1(18.03,6.17) v1(18.03,5.03) v1(18.16,16.71) v1(18.16,15.57) v1(18.16,14.3) v1(18.16,13.15) v1(19.3,7.95) v1(19.3,6.8) v1(19.3,5.53) v1(19.43,16.07) v1(19.43,14.8) v1(19.43,13.66) v1(20.7,8.58) v1(20.7,7.44) v1(20.7,6.17) v1(20.83,15.57) v1(20.83,14.3) v1(20.83,13.15) v1(45.34,8.58) v1(45.34,7.44) v1(45.34,6.17) v1(45.34,5.03) v1(45.59,16.71) v1(45.59,15.57) v1(45.59,13.15) v1(46.48,7.82) v1(46.48,6.68) v1(46.48,5.41) v1(46.74,16.07) v1(46.74,14.8) v1(46.74,13.66) v1(47.62,8.45) v1(47.62,7.44) v1(47.62,6.17) v1(47.62,5.03) v1(47.88,16.71) v1(47.88,15.57) v1(47.88,14.3) v1(47.88,13.15)
$1N5930: length 2.3
  Top Layer w0.305: C1.2 26.17,9.78 U1.3
$1N5954: length 2.7
  Top Layer w0.305: U1.4 26.68,11.07 26.68,10.88 26.69,10.88 26.69,10.6 28.19,9.09 C1.1
$1N6062: length 7.3
  Top Layer w0.305: v1(28.32,11.12) 29.72,9.72 C5.2 ; v1(28.32,11.12) 28.36,11.16 U1.7 ; v1(28.32,11.12) 28.28,11.08 U1.6
  Bottom Layer w0.305: v1(28.32,14.42) v1(28.32,11.12)
$1N6123: length 13
  Top Layer w0.305: U1.24 24.15,11.78 v1(22.73,10.36)
  Bottom Layer w0.305: v1(16.26,4.85) 16.26,4.91 17.15,5.79 17.15,8.96 17.78,9.6 21.97,9.6 v1(22.73,10.36)
$1N6219: length 16
  Top Layer w0.305: v1(20.7,10.49) 22.99,12.78 U1.22
  Bottom Layer w0.305: v1(20.7,10.49) 17.02,10.49 16.13,9.6 16.13,5.66 v1(14.46,3.99)
$1N6658: length 13.2
  Top Layer w0.305: U1.17 25.67,16.06 25.4,16.33 v1(24.89,16.33)
  Bottom Layer w0.305: v1(24.89,16.33) 24.41,16.33 23.47,15.39 23.47,14.3 21.46,12.29 17.06,12.29 v1(16.33,13.03)
$1N7382: length 2.6
  Top Layer w0.305: U3.3 38.35,9.66 C8.2
$1N7386: length 2.3
  Top Layer w0.305: C8.1 37.85,10.42 U3.4
$1N7388: length 4.6
  Top Layer w0.305: U3.8 35.32,7.05 34.67,7.69 C13.2
$1N7390: length 7
  Top Layer w0.305: v1(36.19,8.2) 36.81,8.2 U3.6 ; v1(36.19,8.2) 36.15,8.16 U3.7 ; v1(36.19,8.2) C12.2
  Bottom Layer w0.305: v1(36.19,4.9) v1(36.19,8.2)
$1N7398: length 16.1
  Top Layer w0.305: U3.24 40.13,7.63 v1(40.13,8.07)
  Bottom Layer w0.305: v1(49.89,16.84) 49.91,16.81 49.91,13.28 48.39,11.76 43.81,11.76 v1(40.13,8.07)
$1N7402: length 19.3
  Top Layer w0.305: U3.22 41.14,6.55 v1(41.15,6.55)
  Bottom Layer w0.305: v1(41.15,6.55) 41.15,7.56 44.45,10.87 48.9,10.87 50.95,12.92 50.95,16.84 v1(51.81,17.7)
$1N7417: length 15.8
  Top Layer w0.305: v1(40.77,3.25) 39.23,3.25 38.85,3.63 U3.17
  Bottom Layer w0.305: v1(49.77,8.66) 49.21,9.22 44.45,9.22 42.42,7.18 42.42,4.9 v1(40.77,3.25)
$1N8697: length 4.1
  Top Layer w0.305: LED2.2 30.12,1.47 R7.1
$1N9446: length 4
  Top Layer w0.305: LED1.2 45.68,1.47 R6.2
$1N9774: length 18.5
  Top Layer w0.305: U1.19 24.42,14.32 24.26,14.32 23.24,15.34 23.24,18.11 22.1,19.25 11.43,19.25 10.78,18.6 v1(10.78,17.7)
$1N9780: length 17.7
  Top Layer w0.305: v1(55.75,3.98) 55.75,3.22 55.14,2.61 43.2,2.61 40.77,5.05 U3.19
$1N16923: length 3.1
  Top Layer w0.305: C9.1 40.5,10.49 38.85,8.83 U3.2
$1N17082: length 11.6
  Top Layer w0.305: U3.1 40.46,9.34 41.15,9.34 42.1,10.3 C9.2 C11.1 39.82,14.17 D3.1 C10.2
$1N17114: length 2.1
  Top Layer w0.305: C2.1 25.67,9.29 U1.2
$1N17118: length 10.7
  Top Layer w0.305: 29.65,4.9 26.6,4.9 C4.1 C2.2 24.06,9.98 U1.1
$1N20092: length 22.2
  Top Layer w1.016: 正转1.1 8.42,8.71 2.54,8.71 1.02,10.23 1.02,12.39 2.73,14.11 6.42,14.11 6.73,14.42 R8.2 ; 反转1.2 9.15,14.44
$1N20294: length 20.3
  Top Layer w0.762: 反转2.2 57.53,10.91 R9.2
  Top Layer w1.016: 正转2.1 58.63,18.87 62.74,18.87 64.9,16.71 64.9,15.44 62.37,12.91 57.66,12.91 R9.2

## Copper pours and planes (outline as drawn; the poured copper is in the pictures)
GND on Top Layer: 51.56,4.9 54.99,4.9 54.99,3.12 51.56,3.12
GND on Top Layer: 11.5,18.7 15.19,18.7 15.19,16.95 11.5,16.95
GND on Top Layer: 52.45,18.74 56.22,18.74 56.22,16.86 52.45,16.86
GND on Top Layer: 10.15,5.15 13.59,5.15 13.72,5.03 13.72,2.87 13.59,2.74 10.16,2.74 10.03,2.87 10.03,5.03
GND on GND: 0.26,26.99 65.93,26.99 65.93,0.26 0.26,0.26
LA on Top Layer: 17.02,10.23 17.02,5.41 10.06,5.41 10.06,10.23
LA on VM: 0.26,13.47 15.24,13.47 15.24,5.81 0.26,5.81
LB on Top Layer: 16.6,17.43 17.04,17.43 17.04,13.79 15.62,13.79 15.37,13.53 15.37,10.87 10.28,10.87 10.28,16.51 15.24,16.51 15.75,17.34 16.51,17.34
LB on VM: 0.26,18.47 15.03,18.47 15.03,11.02 0.26,11.02
RA on Top Layer: 49.16,15.96 49.4,16.2 50.98,16.2 51.22,16.44 56,16.44 56.22,16.22 56.22,11.58 55.88,11.25 49.4,11.25 49.15,11.5 49.16,11.51
RA on VM: 51.37,18.47 65.93,18.47 65.93,12.27 51.37,12.27
RB on Top Layer: 49.02,4.47 49.24,4.25 50.41,4.25 51.44,5.28 56.13,5.28 56.51,5.66 56.51,10.11 56.13,10.49 51.58,10.49 51.16,10.07 51.16,8.44 50.8,8.07 49.4,8.07 49.02,7.69
RB on VM: 51.42,13.82 65.93,13.82 65.93,5.42 51.42,5.42
VM on VM: 0.26,26.99 65.93,26.99 65.93,0.26 0.26,0.26

Small or netless copper shapes (teardrops, artwork), in the pictures only: 68 on Top Layer, 19 on Bottom Layer, 24 on VM, 15 on GND

## Text on the board
Top Layer: 2024.5.2 | 安徽科技学院 | 磁力狂飙
Top Solder Mask Layer: 2024.5.2 | 安徽科技学院 | 磁力狂飙
